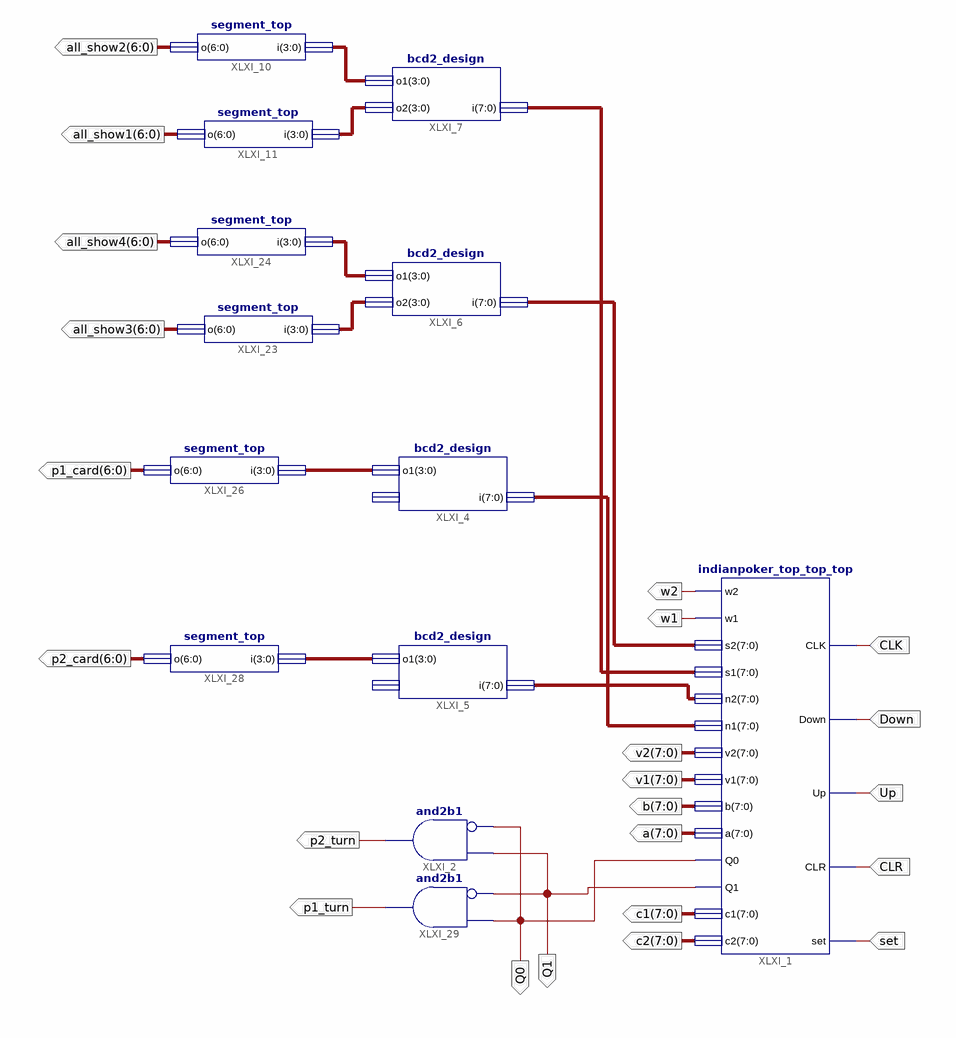
[diagram p0: schematic sheet 1]
// Xilinx ISE schematic indianpoker_final.sch (spartan3) as structural Verilog: 13 symbols, 23 ports
module indianpoker_final (
  input  CLK,
  input  Down,
  input  Up,
  input  CLR,
  input  set,
  output p2_turn,
  output p1_turn,
  output [6:0] all_show2,
  output [6:0] all_show1,
  output [6:0] all_show4,
  output [6:0] all_show3,
  output [6:0] p1_card,
  output [6:0] p2_card,
  output [7:0] v2,
  output [7:0] v1,
  output [7:0] b,
  output [7:0] a,
  output [7:0] c1,
  output [7:0] c2,
  output Q0,
  output Q1,
  output w2,
  output w1
);

  wire [3:0] XLXN_30, XLXN_31, XLXN_32, XLXN_33, XLXN_34, XLXN_35;
  wire [7:0] XLXN_5, XLXN_6, XLXN_42, XLXN_43;

  indianpoker_top_top_top XLXI_1 (
    .set(set), .CLR(CLR), .Up(Up), .Down(Down), .CLK(CLK), .c2(c2), .c1(c1), .Q1(Q1), .Q0(Q0), .a(a), .b(b),
    .v1(v1), .v2(v2), .n1(XLXN_5), .n2(XLXN_6), .s1(XLXN_43), .s2(XLXN_42), .w1(w1), .w2(w2));
  and XLXI_2 (p2_turn, ~Q0, Q1);  // and2b1
  bcd2_design XLXI_7 (.i(XLXN_43), .o2(XLXN_34), .o1(XLXN_35));
  bcd2_design XLXI_6 (.i(XLXN_42), .o2(XLXN_32), .o1(XLXN_33));
  bcd2_design XLXI_4 (.i(XLXN_5), .o1(XLXN_31));  // open: o2
  bcd2_design XLXI_5 (.i(XLXN_6), .o1(XLXN_30));  // open: o2
  segment_top XLXI_11 (.i(XLXN_34), .o(all_show1));
  segment_top XLXI_10 (.i(XLXN_35), .o(all_show2));
  segment_top XLXI_23 (.i(XLXN_32), .o(all_show3));
  segment_top XLXI_24 (.i(XLXN_33), .o(all_show4));
  segment_top XLXI_26 (.i(XLXN_31), .o(p1_card));
  segment_top XLXI_28 (.i(XLXN_30), .o(p2_card));
  and XLXI_29 (p1_turn, ~Q1, Q0);  // and2b1
endmodule
